# EAGLE design CANInput (EAGLE 9.6.2)
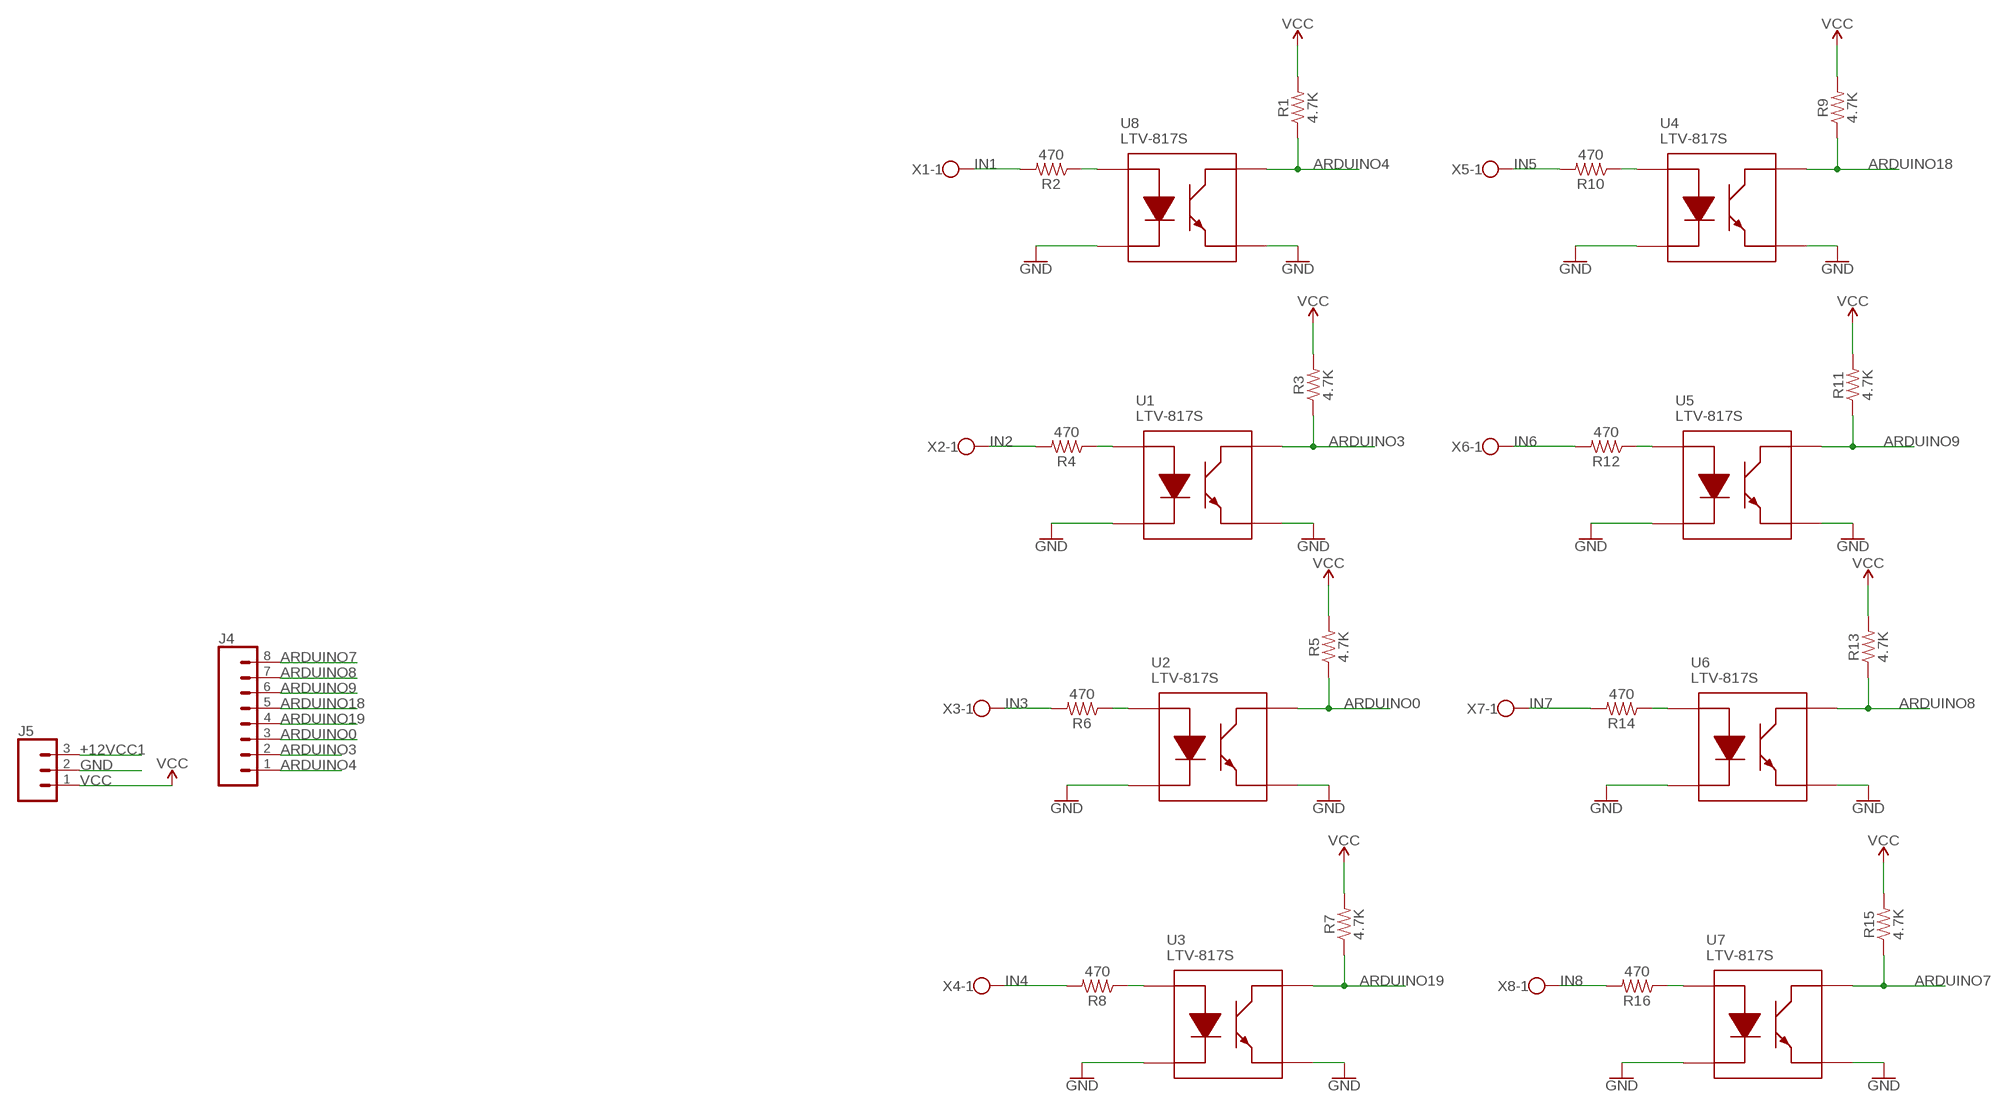
[diagram p0: schematic, sheet 1]

## Parts
J4  CONN_08LOCK  [1X08_LOCK]
J5  CONN_03LOCK  [1X03_LOCK]
R1  4.7K  1KOHM-0603-1/10W-1%  [0603]
R2  470  1KOHM-0603-1/10W-1%  [0603]
R3  4.7K  1KOHM-0603-1/10W-1%  [0603]
R4  470  1KOHM-0603-1/10W-1%  [0603]
R5  4.7K  1KOHM-0603-1/10W-1%  [0603]
R6  470  1KOHM-0603-1/10W-1%  [0603]
R7  4.7K  1KOHM-0603-1/10W-1%  [0603]
R8  470  1KOHM-0603-1/10W-1%  [0603]
R9  4.7K  1KOHM-0603-1/10W-1%  [0603]
R10  470  1KOHM-0603-1/10W-1%  [0603]
R11  4.7K  1KOHM-0603-1/10W-1%  [0603]
R12  470  1KOHM-0603-1/10W-1%  [0603]
R13  4.7K  1KOHM-0603-1/10W-1%  [0603]
R14  470  1KOHM-0603-1/10W-1%  [0603]
R15  4.7K  1KOHM-0603-1/10W-1%  [0603]
R16  470  1KOHM-0603-1/10W-1%  [0603]
U1  LTV-817S  [SOP254P1016X460-4N]
U2  LTV-817S  [SOP254P1016X460-4N]
U3  LTV-817S  [SOP254P1016X460-4N]
U4  LTV-817S  [SOP254P1016X460-4N]
U5  LTV-817S  [SOP254P1016X460-4N]
U6  LTV-817S  [SOP254P1016X460-4N]
U7  LTV-817S  [SOP254P1016X460-4N]
U8  LTV-817S  [SOP254P1016X460-4N]
X1  W237-102  [W237-102]
X2  W237-102  [W237-102]
X3  W237-102  [W237-102]
X4  W237-102  [W237-102]
X5  W237-102  [W237-102]
X6  W237-102  [W237-102]
X7  W237-102  [W237-102]
X8  W237-102  [W237-102]

## Nets
+12VCC1: J5.3
ARDUINO0: J4.3 R5.1 U2.4(COLLECTOR)
ARDUINO3: J4.2 R3.1 U1.4(COLLECTOR)
ARDUINO4: J4.1 R1.1 U8.4(COLLECTOR)
ARDUINO7: J4.8 R15.1 U7.4(COLLECTOR)
ARDUINO8: J4.7 R13.1 U6.4(COLLECTOR)
ARDUINO9: J4.6 R11.1 U5.4(COLLECTOR)
ARDUINO18: J4.5 R9.1 U4.4(COLLECTOR)
ARDUINO19: J4.4 R7.1 U3.4(COLLECTOR)
GND: J5.2 U1.2(CATHODE) U1.3(EMITTER) U2.2(CATHODE) U2.3(EMITTER) U3.2(CATHODE) U3.3(EMITTER) U4.2(CATHODE) U4.3(EMITTER) U5.2(CATHODE) U5.3(EMITTER) U6.2(CATHODE) U6.3(EMITTER) U7.2(CATHODE) U7.3(EMITTER) U8.2(CATHODE) U8.3(EMITTER)
IN1: R2.2 X1.1
IN2: R4.2 X2.1
IN3: R6.2 X3.1
IN4: R8.2 X4.1
IN5: R10.2 X5.1
IN6: R12.2 X6.1
IN7: R14.2 X7.1
IN8: R16.2 X8.1
N$2: R4.1 U1.1(ANODE)
N$4: R6.1 U2.1(ANODE)
N$6: R8.1 U3.1(ANODE)
N$8: R10.1 U4.1(ANODE)
N$10: R12.1 U5.1(ANODE)
N$12: R14.1 U6.1(ANODE)
N$14: R16.1 U7.1(ANODE)
N$21: R2.1 U8.1(ANODE)
VCC: J5.1 R1.2 R3.2 R5.2 R7.2 R9.2 R11.2 R13.2 R15.2
Unconnected: X1.2 X2.2 X3.2 X4.2 X5.2 X6.2 X7.2 X8.2

## Library data of the parts
J4 = SparkFun-Connectors:CONN_08: Multi connection point. Often used as Generic Header-pin footprint for 0.1 inch spaced/style header connections On any of the 0.1 inch spaced packages, you can populate with these: Break Away Headers - Straight <https://www.sparkfun.com/products/116> (PRT-00116) Break Away Male Headers - Right Angle <https://www.sparkfun.com/products/553> (PRT-00553) Female Headers <https://www.sparkfun.com/products/115> (PRT-00115) Break Away Headers - Machine Pin <https://www.sparkfun.com/products/117> (PRT-00117) Break Away Female Headers - Swiss Machine Pin <https://www.sparkfun.com/products/743> (PRT-00743) Arduino Stackable Header - 8 Pin <https://www.sparkfun.com/products/9279> (PRT-09279) For SCREWTERMINALS and SPRING TERMINALS visit here: Screw Terimnals on SparkFun.com <https://www.sparkfun.com/search/results?term=Screw+Terminals> (5mm/3.5mm/2.54mm spacing) This device is also useful as a general connection point to wire up your design to another part of your project. Our various solder wires solder well into these plated through hole pads. Hook-Up Wire - Assortment (Stranded, 22 AWG) <https://www.sparkfun.com/products/11375> (PRT-11375) Hook-Up Wire - Assortment (Solid Core, 22 AWG) <https://www.sparkfun.com/products/11367> (PRT-11367) View the entire wire category on our website here <https://www.sparkfun.com/categories/141> Special notes: Molex polarized connector foot print use with SKU : PRT-08231 with associated crimp pins and housings. 1MM SMD Version SKU: PRT-10208 NOTES ON THE VARIANTS LOCK and LOCK_LONGPADS... This footprint was designed to help hold the alignment of a through-hole component (i.e. 6-pin header) while soldering it into place. You may notice that each hole has been shifted either up or down by 0.005 of an inch from it's more standard position (which is a perfectly straight line). This slight alteration caused the pins (the squares in the middle) to touch the edges of the holes. Because they are alternating, it causes a "brace" to hold the component in place. 0.005 has proven to be the perfect amount of "off-center" position when using our standard breakaway headers. Although looks a little odd when you look at the bare footprint, once you have a header in there, the alteration is very hard to notice. Also,if you push a header all the way into place, it is covered up entirely on the bottom side.
J5 = SparkFun-Connectors:CONN_03: Multi connection point. Often used as Generic Header-pin footprint for 0.1 inch spaced/style header connections On any of the 0.1 inch spaced packages, you can populate with these: Break Away Headers - Straight <https://www.sparkfun.com/products/116> (PRT-00116) Break Away Male Headers - Right Angle <https://www.sparkfun.com/products/553> (PRT-00553) Female Headers <https://www.sparkfun.com/products/115> (PRT-00115) Break Away Headers - Machine Pin <https://www.sparkfun.com/products/117> (PRT-00117) Break Away Female Headers - Swiss Machine Pin <https://www.sparkfun.com/products/743> (PRT-00743) Stackable Header - 3 Pin (Female, 0.1") <https://www.sparkfun.com/products/13875> (PRT-13875) For SCREWTERMINALS and SPRING TERMINALS visit here: Screw Terimnals on SparkFun.com <https://www.sparkfun.com/search/results?term=Screw+Terminals> (5mm/3.5mm/2.54mm spacing) This device is also useful as a general connection point to wire up your design to another part of your project. Our various solder wires solder well into these plated through hole pads. Hook-Up Wire - Assortment (Stranded, 22 AWG) <https://www.sparkfun.com/products/11375> (PRT-11375) Hook-Up Wire - Assortment (Solid Core, 22 AWG) <https://www.sparkfun.com/products/11367> (PRT-11367) View the entire wire category on our website here <https://www.sparkfun.com/categories/141> Special notes: Molex polarized connector foot print use with SKU : PRT-08232 with associated crimp pins and housings.
R1-R16 = SparkFun-Resistors:1KOHM: 1kΩ resistor A resistor is a passive two-terminal electrical component that implements electrical resistance as a circuit element. Resistors act to reduce current flow, and, at the same time, act to lower voltage levels within circuits. - Wikipedia; PROD_ID: RES-07856; VALUE: 1k
U1-U8 = SamacSys_Parts:LTV-817S: Optocoupler Transistor Output, 35V, SMD4 Lite-On LTV-817S DC Input Transistor Output Optocoupler, Surface Mount, 4-Pin SMD Source: Datasheet <http://optoelectronics.liteon.com/upload/download/DS-70-96-0016/LTV-8X7 series 201610 .pdf>; DESCRIPTION: Optocoupler Transistor Output, 35V, SMD4 Lite-On LTV-817S DC Input Transistor Output Optocoupler, Surface Mount, 4-Pin SMD; HEIGHT: 4.6mm; MANUFACTURER_NAME: Lite-On; MANUFACTURER_PART_NUMBER: LTV-817S; MOUSER_PART_NUMBER: 859-LTV-817S; MOUSER_PRICE-STOCK: https://www.mouser.co.uk/ProductDetail/Lite-On/LTV-817S?qs=XpF7qU%252BvLkWYeWEC0OckNQ%3D%3D
X1-X8 = con-wago-500:W237-102: WAGO SCREW CLAMP; MPN: 237-102; OC_FARNELL: unknown; OC_NEWARK: 70K9898

## Net classes
0 default: width 0.305 mm

## Board
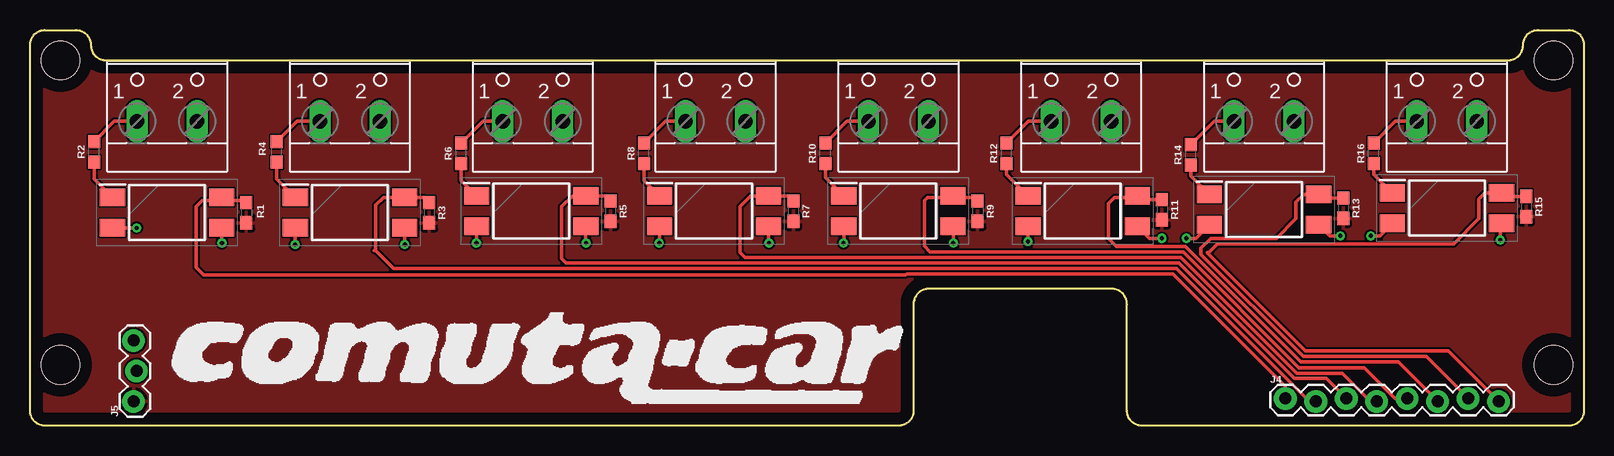
[diagram p1: board, top side]
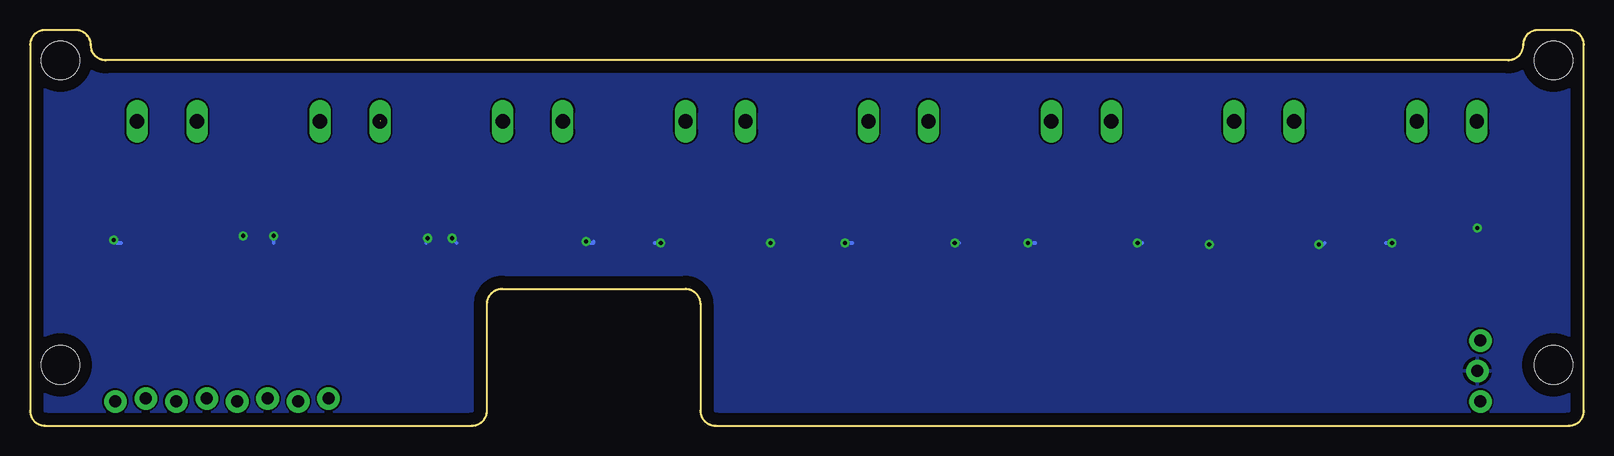
[diagram p2: board, bottom side, seen from below]

Size 129.54 x 33.02 mm. Coordinates in mm from the lower left corner, seen from the top.
Outline: 72.39,0 1.27,0 arc-90 0,1.27 0,31.75 arc-90 1.27,33.02 3.81,33.02 arc-90 5.08,31.75 arc90 6.35,30.48 123.19,30.48 arc90 124.46,31.75 arc-90 125.73,33.02 128.27,33.02 arc-90 129.54,31.75 129.54,1.27 arc-90 128.27,0 92.71,0 arc-90 91.44,1.27 91.44,10.16 arc90 90.17,11.43 74.93,11.43 arc90 73.66,10.16 73.66,1.27 arc-90 72.39,0
Copper layers (1*16): Top 0.035mm / dielectric 1.5mm / Bottom 0.035mm
Design rules "default": minimum track width 6mil, minimum drill 0.35mm, track to track 6mil, track to pad 6mil, pad to pad 6mil, via to via 6mil, smd to smd 6mil, copper to edge 40mil, drill to drill 6mil, minimum pad ring 10mil, minimum via ring 8mil, stop-mask expansion 4mil, vias tented up to drill 0mil, thermal gap 10mil
Holes 3.2 mm at 2.54,30.48 2.54,5.08 127,5.08 127,30.48

### Footprints (pad centres in the part's own frame; a part is rotated, then mirrored left to right if it is on the bottom)
1X08_LOCK = drill 1.016 pad 1.88: 1 0,0.127; 2 2.54,-0.127; 3 5.08,0.127; 4 7.62,-0.127; 5 10.16,0.127; 6 12.7,-0.127; 7 15.24,0.127; 8 17.78,-0.127
1X03_LOCK = drill 1.016 pad 1.88: 1 0,0.127; 2 2.54,-0.127; 3 5.08,0.127
0603 = smd 1.1 x 1: 1 -0.85,0; 2 0.85,0
SOP254P1016X460-4N = smd 2.1 x 1.45: 1 -4.55,1.27; 2 -4.55,-1.27; 3 4.55,-1.27; 4 4.55,1.27
W237-102 = drill 1.194 long: 1 -2.5,-1.27; 2 2.5,-1.27

### Placement (x,y rotation side)
J4  104.65,2.16 0 top
J5  8.76,2.03 90 top
R1  18.03,17.78 270 top
R2  5.33,22.86 90 top
R3  33.27,17.78 270 top
R4  20.57,22.86 90 top
R5  48.39,17.91 270 top
R6  35.94,22.73 90 top
R7  63.63,17.91 270 top
R8  51.18,22.73 90 top
R9  78.99,17.91 270 top
R10  66.29,22.73 90 top
R11  94.36,18.03 270 top
R12  81.41,22.73 90 top
R13  109.47,18.16 270 top
R14  96.77,22.61 90 top
R15  124.71,18.29 270 top
R16  112.01,22.73 90 top
U1  26.67,17.78 0 top
U2  41.78,17.91 0 top
U3  57.02,17.91 0 top
U4  72.39,17.91 0 top
U5  87.76,17.91 0 top
U6  102.87,18.03 0 top
U7  118.11,18.16 0 top
U8  11.43,17.78 0 top
X1  11.43,26.67 0 top
X2  26.67,26.67 0 top
X3  41.91,26.67 0 top
X4  57.15,26.67 0 top
X5  72.39,26.67 0 top
X6  87.63,26.67 0 top
X7  102.87,26.67 0 top
X8  118.11,26.67 0 top

### Tracks (layer width: path | path; a pad name or v marks a point on that pad's centre or on a via)
ARDUINO0
  Top 0.305: J4.3 108.08,3.94 105.4,3.94 95.75,13.59 44.7,13.59 44.32,13.97 44.32,18.29 45.21,19.18 U2.4 47.97,19.18 R5.1
ARDUINO3
  Top 0.305: J4.2 106.66,2.03 95.56,13.13 30.3,13.13 28.83,14.6 | 28.7,14.6 28.83,14.6 | R3.1 32.85,19.05 U1.4 29.46,19.05 28.83,18.41 28.83,14.6
ARDUINO4
  Top 0.305: U8.4 15.73,18.8 | 15.73,18.8 14.35,18.8 13.84,18.29 13.84,13.21 14.48,12.57 73,12.57 73.1,12.67 95.28,12.67 104.65,3.3 J4.1 | R1.1 17.87,18.8 15.73,18.8
ARDUINO7
  Top 0.305: J4.8 118.21,6.25 106.33,6.25 98.2,14.38 | 98.2,14.38 98.13,14.44 | 98.2,14.38 98.98,15.16 118.67,15.16 120.78,17.27 120.78,18.92 121.28,19.43 U7.4 122.95,19.14 R15.1
ARDUINO8
  Top 0.305: J4.7 116.38,5.79 106.14,5.79 97.62,14.31 97.62,14.82 98.42,15.62 103.89,15.62 105.54,17.27 105.54,18.67 106.17,19.3 U6.4 107.71,19.01 R13.1
ARDUINO9
  Top 0.305: J4.6 114.05,5.33 105.95,5.33 96.32,14.96 90.58,14.96 89.92,15.62 89.92,18.54 90.41,19.04 92.44,19.04 | R11.1 92.6,18.88 92.44,19.04 | 92.44,19.04 U5.4
ARDUINO18
  Top 0.305: J4.5 113.77,2.29 111.21,4.85 105.78,4.85 96.13,14.5 75.03,14.5 74.55,14.99 74.55,18.8 74.8,19.05 76.2,19.05 | R9.1 78.7,19.05 76.2,19.05 | 76.2,19.05 76.33,19.18 U4.4
ARDUINO19
  Top 0.305: J4.4 111.74,2.03 109.38,4.39 105.59,4.39 95.94,14.05 59.61,14.05 59.18,14.48 59.18,18.29 60.07,19.18 U3.4 63.21,19.18 R7.1
GND  (via drill 0.35)
  Top 0.305: U8.2 v8.89,16.51 | U8.3 15.98,15.26 v16,15.24 | U1.2 22.12,15.13 v22.1,15.11 | U1.3 31.22,15.13 v31.24,15.11 | U2.2 37.23,15.26 v37.21,15.24 | U2.3 46.33,15.26 v46.35,15.24 | U3.2 52.47,15.26 v52.45,15.24 | U3.3 61.57,15.26 v61.59,15.24 | U4.2 67.84,15.26 v67.82,15.24 | U4.3 76.96,16.61 v76.96,15.24 | U5.2 83.21,15.39 v83.18,15.37 | U5.3 93.3,15.64 v94.36,15.64 | U6.2 97.2,15.64 v96.39,15.64 | U6.3 108.34,15.85 v109.22,15.85 | U7.2 112.52,15.85 v111.76,15.85 | U7.3 122.55,16.79 v122.55,15.49
  Bottom 0.305: v16,15.24 16.51,15.24 | v22.1,15.11 21.72,15.11 21.59,15.24 | v37.21,15.24 36.83,15.24 | v46.35,15.24 45.72,15.24 | v52.45,15.24 52.07,15.24 | v61.59,15.24 60.96,15.24 | v76.96,15.24 77.47,15.24 | v83.18,15.37 83.06,15.24 82.55,15.24 82.55,15.37 | v94.36,15.64 94.36,15.62 93.98,15.24 | v96.39,15.64 96.52,15.52 96.52,15.24 | v109.22,15.85 109.22,15.24 | v111.76,15.85 111.66,15.75 111.63,15.75 | v122.55,15.49 122.3,15.24 121.92,15.24
  pour Bottom: 0,33.02 129.54,33.02 129.54,0 0,0
IN1
  Top 0.305: R2.2 7.02,25.4 X1.1
IN2
  Top 0.305: R4.2 22.26,25.4 X2.1
IN3
  Top 0.305: R6.2 37.76,25.4 X3.1
IN4
  Top 0.305: R8.2 53,25.4 X4.1
IN5
  Top 0.305: R10.2 68.11,25.4 X5.1
IN6
  Top 0.305: R12.2 83.22,25.4 X6.1
IN7  (1 unrouted)
  Top 0.305: R14.2 98.72,25.4 100.33,25.4
IN8
  Top 0.305: R16.2 113.83,25.4 X8.1
N$2
  Top 0.305: U1.1 20.57,20.6 R4.1
N$4
  Top 0.305: U2.1 35.94,20.47 R6.1
N$6
  Top 0.305: U3.1 51.18,20.47 R8.1
N$8
  Top 0.305: U4.1 66.29,20.72 R10.1
N$10
  Top 0.305: U5.1 81.41,20.98 R12.1
N$12
  Top 0.305: U6.1 96.77,20.85 R14.1
N$14
  Top 0.305: U7.1 112.01,20.98 R16.1
N$21
  Top 0.305: U8.1 5.33,20.6 R2.1
VCC
  pour Top: 129.54,33.02 0,33.02 0,0 129.54,0